# EAGLE schematic ATtiny20 Study (EAGLE 7.2.0)
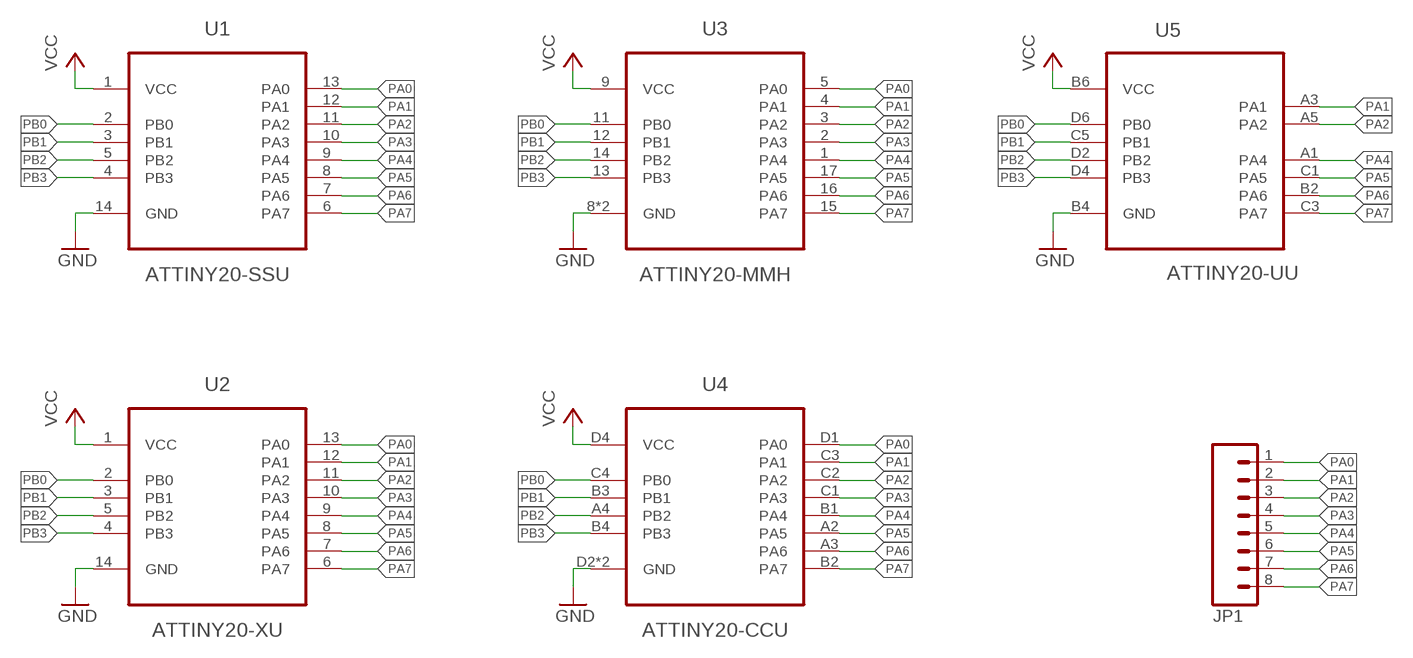
[diagram p0: schematic, sheet 1]

## Parts
JP1  M08LOCK_NO_SILK  [1X08_LOCK_NO_SILK]
U1  ATTINY20-SSU  [14S1]
U2  ATTINY20-XU  [14X]
U3  ATTINY20-MMH  [20M2]
U4  ATTINY20-CCU  [15CC1]
U5  ATTINY20-UU  [12U-1]

## Nets
GND: U1.14(GND) U2.14(GND) U3.8(GND) U3.PAD(GND) U4.D2(GND) U4.D3(GND) U5.B4(GND)
PA0: JP1.1 U1.13(PA0) U2.13(PA0) U3.5(PA0) U4.D1(PA0)
PA1: JP1.2 U1.12(PA1) U2.12(PA1) U3.4(PA1) U4.C3(PA1) U5.A3(PA1)
PA2: JP1.3 U1.11(PA2) U2.11(PA2) U3.3(PA2) U4.C2(PA2) U5.A5(PA2)
PA3: JP1.4 U1.10(PA3) U2.10(PA3) U3.2(PA3) U4.C1(PA3)
PA4: JP1.5 U1.9(PA4) U2.9(PA4) U3.1(PA4) U4.B1(PA4) U5.A1(PA4)
PA5: JP1.6 U1.8(PA5) U2.8(PA5) U3.17(PA5) U4.A2(PA5) U5.C1(PA5)
PA6: JP1.7 U1.7(PA6) U2.7(PA6) U3.16(PA6) U4.A3(PA6) U5.B2(PA6)
PA7: JP1.8 U1.6(PA7) U2.6(PA7) U3.15(PA7) U4.B2(PA7) U5.C3(PA7)
PB0: U1.2(PB0) U2.2(PB0) U3.11(PB0) U4.C4(PB0) U5.D6(PB0)
PB1: U1.3(PB1) U2.3(PB1) U3.12(PB1) U4.B3(PB1) U5.C5(PB1)
PB2: U1.5(PB2) U2.5(PB2) U3.14(PB2) U4.A4(PB2) U5.D2(PB2)
PB3: U1.4(PB3) U2.4(PB3) U3.13(PB3) U4.B4(PB3) U5.D4(PB3)
VCC: U1.1(VCC) U2.1(VCC) U3.9(VCC) U4.D4(VCC) U5.B6(VCC)

## Library data of the parts
JP1 = SparkFun-Connectors:M08: Header 8 Standard 8-pin 0.1" header. Use with straight break away headers (SKU : PRT-00116), right angle break away headers (PRT-00553), swiss pins (PRT-00743), machine pins (PRT-00117), and female headers (PRT-00115).
U1 = Atmel_AVR8:ATTINY20: 8-bit Microcontroller with Bytes In-System Programmable Flash; MPN: ATTINY20-SSU; PACKAGE: SOIC-14; SUPPLIER: Atmel
U2-U4 = Atmel_AVR8:ATTINY20: 8-bit Microcontroller with Bytes In-System Programmable Flash
U5 = Atmel_AVR8:ATTINY20-UU: 8-bit Microcontroller with Bytes In-System Programmable Flash